# EAGLE design LTC Reader V2 (EAGLE 9.3.2)
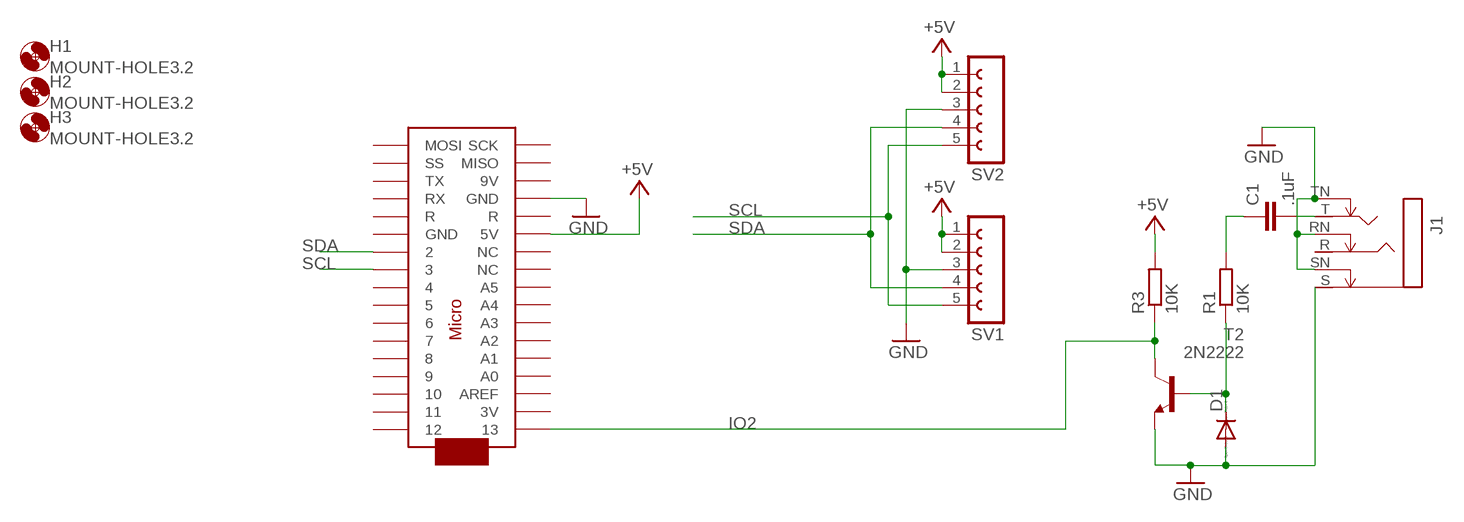
[diagram p0: schematic, sheet 1]

## Parts
C1  .1uF  C5/2.5  [C5B2.5]
D1  1N4148DO35-7  [DO35-7]
H1  MOUNT-HOLE3.2  [3,2]
H2  MOUNT-HOLE3.2  [3,2]
H3  MOUNT-HOLE3.2  [3,2]
J1  STEREOSWS  [NMJ6HC-S]
R1  10K  R-EU_0207/10  [0207/10]
R3  10K  R-EU_0207/10  [0207/10]
SV1  FE05-1  [FE05-1]
SV2  FE05-1  [FE05-1]
T2  2N2222  [TO92-EBC-OVAL]
U$1  ARDUINOMICRO  [ARDUINOMICRO]

## Nets
+5V: R3.2 SV1.1 SV1.2 SV2.1 SV2.2 U$1.P$23(5V)
GND: D1.A J1.RN J1.S J1.SN J1.TN SV1.3 SV2.3 T2.E U$1.P$12(GND)
IO2: R3.1 T2.C U$1.P$34
N$1: C1.1 R1.2
N$4: D1.C R1.1 T2.B
N$6: C1.2 J1.T
SCL: SV1.5 SV2.5 U$1.P$10
SDA: SV1.4 SV2.4 U$1.P$11
Unconnected: J1.R U$1.P$1 U$1.P$2 U$1.P$3 U$1.P$4 U$1.P$5 U$1.P$6 U$1.P$7 U$1.P$8 U$1.P$9 U$1.P$13(R) U$1.P$14(RX) U$1.P$15(TX) U$1.P$16(SS) U$1.P$17(MOSI) U$1.P$18(SCK) U$1.P$19(MISO) U$1.P$20(9V) U$1.P$21(GND) U$1.P$22(R) U$1.P$24(NC) U$1.P$25(NC) U$1.P$26(A5) U$1.P$27(A4) U$1.P$28(A3) U$1.P$29(A2) U$1.P$30(A1) U$1.P$31(A0) U$1.P$32(AREF) U$1.P$33(3V)

## Library data of the parts
C1 = capacitor-wima:C: CAPACITOR naming: grid - package width
D1 = diode:1N4148: DIODE high speed (Philips)
H1-H3 = holes:MOUNT-HOLE: MOUNTING HOLE with drill center marker
J1 = gm-jacks:STEREOSW
R1 R3 = rcl:R-EU_: RESISTOR, European symbol; SPICEPREFIX: R
SV1 SV2 = con-lsta:FE05-1: FEMALE HEADER; OC_FARNELL: unknown; OC_NEWARK: unknown
T2 = adafruit2:2N2222: NPN TRANSISTOR Big oval pads
U$1 = adafruit2:ARDUINOMICRO

## Net classes
0 default: width 0.152 mm, drill 0.305 mm, clearance 0.152 mm

## Board
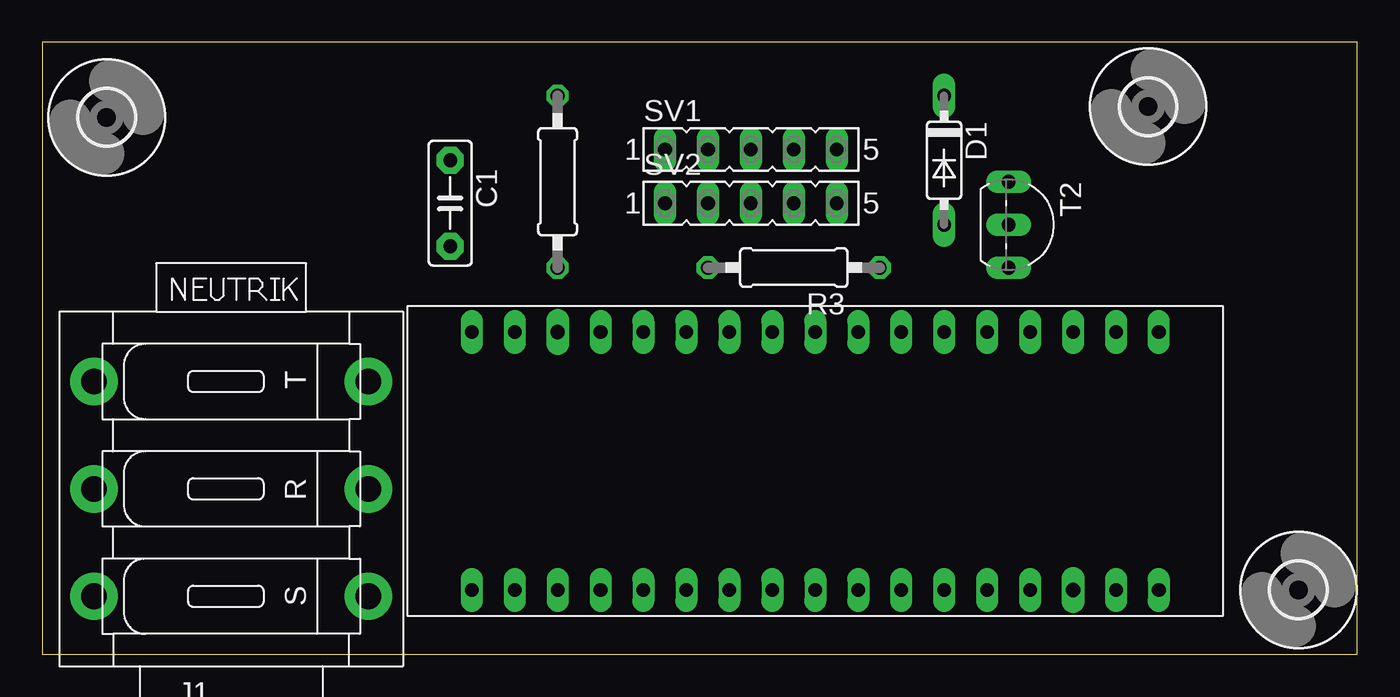
[diagram p1: board, top side]
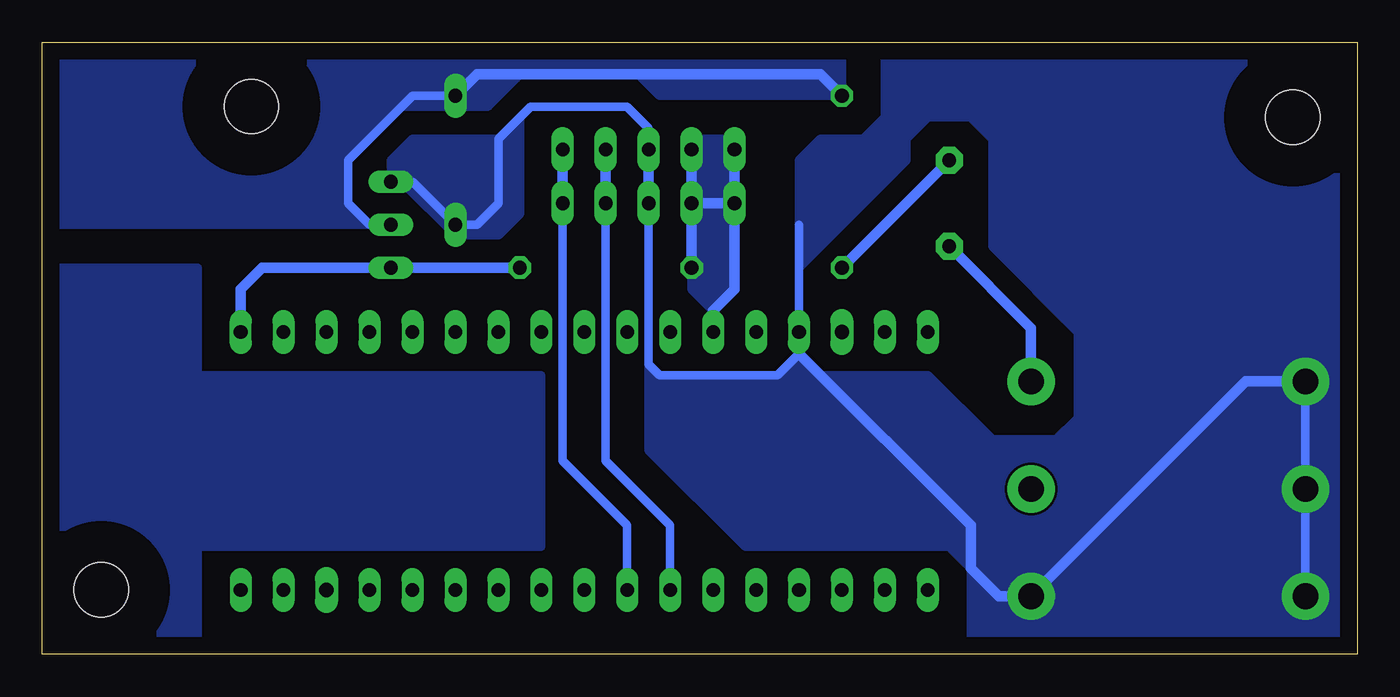
[diagram p2: board, bottom side, seen from below]

Size 77.78 x 36.19 mm. Coordinates in mm from the lower left corner, seen from the top.
Outline: 0,0 77.78,0 77.78,36.19 0,36.19 0,0
Copper layers (1*16): Top 0.035mm / dielectric 1.5mm / Bottom 0.035mm
Design rules "default": minimum track width 6mil, minimum drill 0.35mm, track to track 6mil, track to pad 6mil, pad to pad 6mil, via to via 6mil, smd to smd 6mil, copper to edge 40mil, drill to drill 6mil, minimum pad ring 10mil, minimum via ring 8mil, stop-mask expansion 4mil, vias tented up to drill 0mil, thermal gap 10mil

### Footprints (pad centres in the part's own frame; a part is rotated, then mirrored left to right if it is on the bottom)
C5B2.5 = drill 0.813 pad 1.6 octagon: 1 -2.54,0; 2 2.54,0
DO35-7 = drill 0.813 long: A 3.81,0; C -3.81,0
3,2 = hole 3.2: 0,0
NMJ6HC-S = drill 1.524 pad 2.794: R 0,8.115; RN 0,-8.115; S 6.35,8.115; SN 6.35,-8.115; T -6.35,8.115; TN -6.35,-8.115
0207/10 = drill 0.813 octagon: 1 -5.08,0; 2 5.08,0
FE05-1 = drill 0.813 long: 1 -5.08,0; 2 -2.54,0; 3 0,0; 4 2.54,0; 5 5.08,0
TO92-EBC-OVAL = drill 0.813 long: B 0,-1.27; C 2.54,-1.27; E -2.54,-1.27
ARDUINOMICRO = drill 0.8 long: P$1 -20.32,7.62; P$2 -17.78,7.62; P$4 -12.7,7.62; P$5 -10.16,7.62; P$6 -7.62,7.62; P$7 -5.08,7.62; P$8 -2.54,7.62; P$9 0,7.62; P$10 2.54,7.62; P$11 5.08,7.62; P$12 12.7,-7.62; P$13 10.16,-7.62; P$14 12.7,7.62; P$15 15.24,7.62; P$16 17.78,7.62; P$17 20.32,7.62; P$18 20.32,-7.62; P$19 17.78,-7.62; P$21 7.62,7.62; P$22 10.16,7.62; P$23 7.62,-7.62; P$24 5.08,-7.62; P$25 2.54,-7.62; P$26 0,-7.62; P$27 -2.54,-7.62; P$28 -5.08,-7.62; P$29 -7.62,-7.62; P$30 -10.16,-7.62; P$31 -12.7,-7.62; P$32 -15.24,-7.62; P$33 -17.78,-7.62; P$34 -20.32,-7.62 | drill 0.85 long: P$3 -15.24,7.62; P$20 15.24,-7.62

### Placement (x,y rotation side)
C1  24.13,26.67 270 top
D1  53.34,29.21 270 top
H1  3.81,31.75 0 top
H2  74.3,3.81 0 top
H3  65.41,32.38 0 top
J1  11.18,9.78 270 top
R1  30.48,27.94 270 top
R3  44.45,22.86 180 top
SV1  41.91,29.84 0 top
SV2  41.91,26.67 0 top
T2  58.42,25.4 270 top
U$1  45.72,11.43 180 top

### Tracks (layer width: path | path; a pad name or v marks a point on that pad's centre or on a via)
+5V
  Bottom 0.61: SV1.1 SV2.1 | SV1.2 SV2.2 | SV2.2 SV2.1 | SV2.1 36.83,21.59 38.1,20.32 U$1.P$23 | SV2.2 R3.2
  pour Bottom (no thermals): 36.83,30.48 39.37,30.48 39.37,21.59 38.1,20.32 36.83,21.59
FILLER
  pour Bottom: 48.26,16.51 48.26,6.35 68.58,6.35 68.58,0 77.47,0 77.47,22.86 68.58,22.86 68.58,16.51
GND
  Bottom 0.508: T2.E 55.88,27.94 D1.A 52.07,25.4 50.8,26.67 50.8,30.48 48.9,32.38 43.18,32.38 41.91,31.11 SV1.3 | SV2.3 41.91,17.14 41.27,16.51 34.29,16.51 33.02,17.78 U$1.P$12 33.02,25.4 | J1.SN J1.RN J1.TN
  Bottom 0.61: J1.TN 6.59,16.13 J1.S 21.21,3.43 22.86,5.08 22.86,7.62 33.02,17.78 | SV1.3 SV2.3
  pour Bottom (no thermals): 22.86,5.08 22.86,0 0,0 0,35.56 27.94,35.56 27.94,31.75 29.21,30.48 31.75,30.48 33.02,29.21 33.02,22.86 26.67,29.21 26.67,30.48 25.4,31.75 22.86,31.75 21.59,30.48 21.59,24.13 16.51,19.05 16.51,13.97 17.78,12.7 21.59,12.7 25.4,16.51 31.75,16.51 33.02,17.78 34.29,16.51 41.27,16.51 41.91,17.14 41.91,12.06 36.2,6.35 24.13,6.35
  pour Bottom (no thermals): 57.15,27.94 57.15,29.21 55.88,30.48 50.8,30.48 49.53,31.75 49.53,26.67 49.53,26.04 50.8,24.77 53.34,24.77 56.52,27.94
IO2
  Bottom 0.508: T2.C R3.1
  Bottom 0.61: U$1.P$34 66.04,21.59 64.77,22.86 R3.1
N$1
  Bottom 0.61: C1.1 R1.2
N$4
  Bottom 0.508: T2.B 58.42,25.4 59.69,26.67 59.69,29.21 55.88,33.02 D1.C
  Bottom 0.61: R1.1 31.75,34.29 52.07,34.29 D1.C
  pour Bottom (no thermals): 30.48,33.02 40.64,33.02 41.27,33.02 42.55,34.29 49.53,34.29 50.8,33.02 51.44,32.38 56.52,32.38 59.69,29.21 59.69,26.67 58.42,25.4 77.47,25.4 77.47,35.56 30.48,35.56
N$6
  Bottom 0.61: J1.T 19.29,19.29 C1.2
  Bottom 0.813: 19.43,16.13 J1.T
SCL
  Bottom 0.508: SV2.5 46.99,11.43 43.18,7.62 U$1.P$10
  Bottom 0.61: SV1.5 SV2.5
SDA
  Bottom 0.508: U$1.P$11 40.64,7.62 44.45,11.43 SV2.4
  Bottom 0.61: SV1.4 SV2.4